# EAGLE design SerialTrainSensor_drill (EAGLE 6.1)
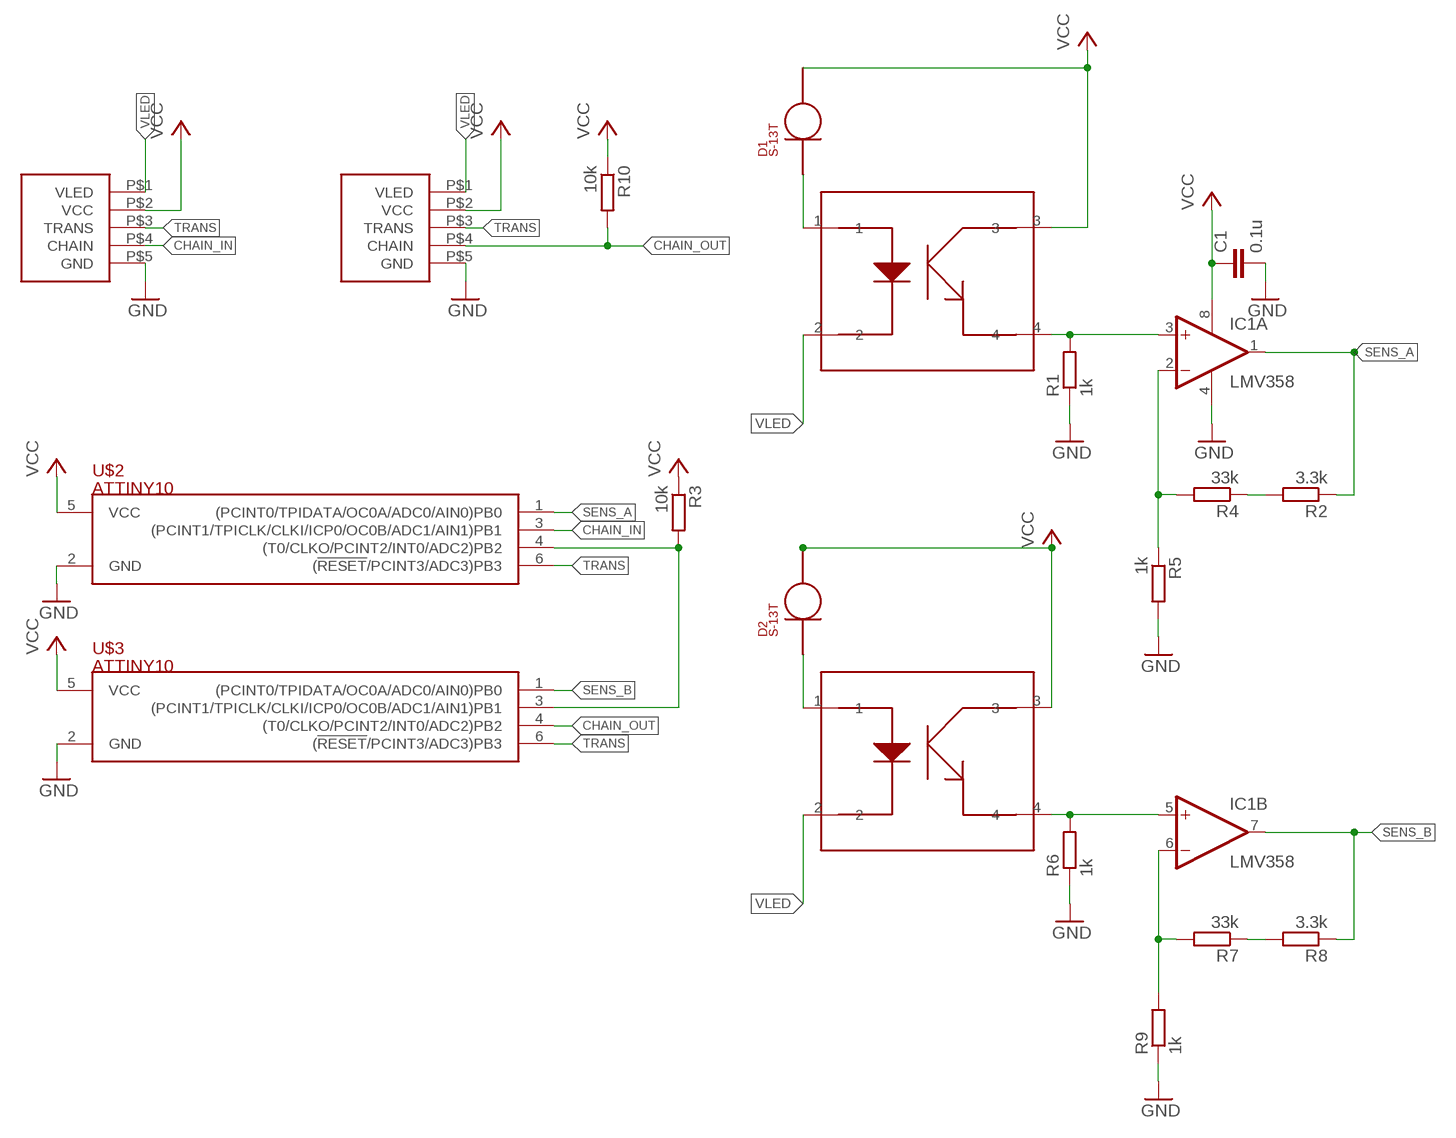
[diagram p0: schematic, sheet 1]

## Parts
C1  0.1u  C-EUC0603  [C0603]
D1  S-13T  [S-1*3T]
D2  S-13T  [S-1*3T]
IC1  LMV358  [TSSOP8]
R1  1k  R-EU_R0603  [R0603]
R2  3.3k  R-EU_R0603  [R0603]
R3  10k  R-EU_R0603  [R0603]
R4  33k  R-EU_R0603  [R0603]
R5  1k  R-EU_R0603  [R0603]
R6  1k  R-EU_R0603  [R0603]
R7  33k  R-EU_R0603  [R0603]
R8  3.3k  R-EU_R0603  [R0603]
R9  1k  R-EU_R0603  [R0603]
R10  10k  R-EU_R0603  [R0603]
SMD1  SERIAL_SENSORHALF  [SERIAL_5_HALF]
SMD2  SERIAL_SENSORHALF  [SERIAL_5_HALF]
U$1  TPR-105F  [TPR-105F]
U$2  ATTINY10  [SOT-23]
U$3  ATTINY10  [SOT-23]
U$4  TPR-105F  [TPR-105F]

## Nets
CHAIN_IN: SMD1.P$4(CHAIN) U$2.3((PCINT1/TPICLK/CLKI/ICP0/OC0B/ADC1/AIN1)PB1)
CHAIN_OUT: R10.2 SMD2.P$4(CHAIN) U$3.4((T0/CLKO/PCINT2/INT0/ADC2)PB2)
GND: C1.2 IC1.4(P:V-) R1.1 R5.2 R6.1 R9.1 SMD1.P$5(GND) SMD2.P$5(GND) U$2.2(GND) U$3.2(GND)
N$1: D1.C U$1.1
N$2: IC1.3(A:+IN) R1.2 U$1.4
N$3: D2.C U$4.1
N$4: R3.2 U$2.4((T0/CLKO/PCINT2/INT0/ADC2)PB2) U$3.3((PCINT1/TPICLK/CLKI/ICP0/OC0B/ADC1/AIN1)PB1)
N$5: IC1.5(B:+IN) R6.2 U$4.4
N$6: IC1.2(A:-IN) R4.2 R5.1
N$7: IC1.6(B:-IN) R7.2 R9.2
N$8: R2.2 R4.1
N$9: R7.1 R8.2
SENS_A: IC1.1(A:OUT) R2.1 U$2.1((PCINT0/TPIDATA/OC0A/ADC0/AIN0)PB0)
SENS_B: IC1.7(B:OUT) R8.1 U$3.1((PCINT0/TPIDATA/OC0A/ADC0/AIN0)PB0)
TRANS: SMD1.P$3(TRANS) SMD2.P$3(TRANS) U$2.6((!RESET!/PCINT3/ADC3)PB3) U$3.6((!RESET!/PCINT3/ADC3)PB3)
VCC [vcc]: C1.1 D1.A D2.A IC1.8(P:V+) R3.1 R10.1 SMD1.P$2(VCC) SMD2.P$2(VCC) U$1.3 U$2.5(VCC) U$3.5(VCC) U$4.3
VLED [led]: SMD1.P$1(VLED) SMD2.P$1(VLED) U$1.2 U$4.2

## Library data of the parts
C1 = rcl:C-EU: CAPACITOR, European symbol
D1 D2 = myparts:S-1*3T
IC1 = myparts:LMV358?*: Dual General Purpose, Low Voltage, Rail-to-Rail Output Operational Amplifiers Source: http://www.national.com/mpf/LM/LMV321.html http://www.national.com/dt/lmv_qual.pdf
R1-R10 = rcl:R-EU_: RESISTOR, European symbol
SMD1 SMD2 = myparts:SERIAL_SENSOR
U$1 U$4 = myparts:TPR-105F
U$2 U$3 = myparts:ATTINY10

## Net classes
1 led: width 0.381 mm
2 vcc: width 0.254 mm

## Board
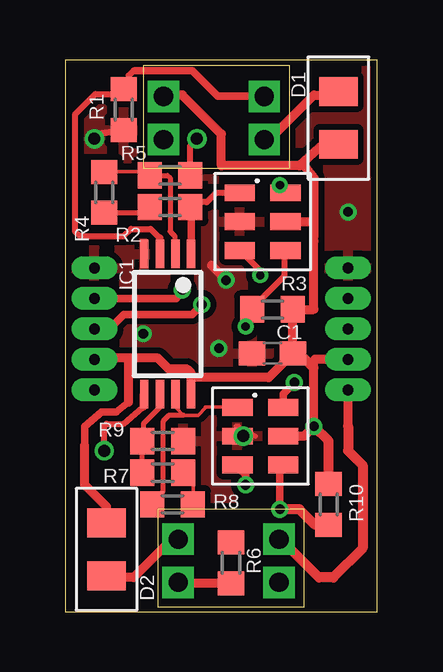
[diagram p1: board, top side]
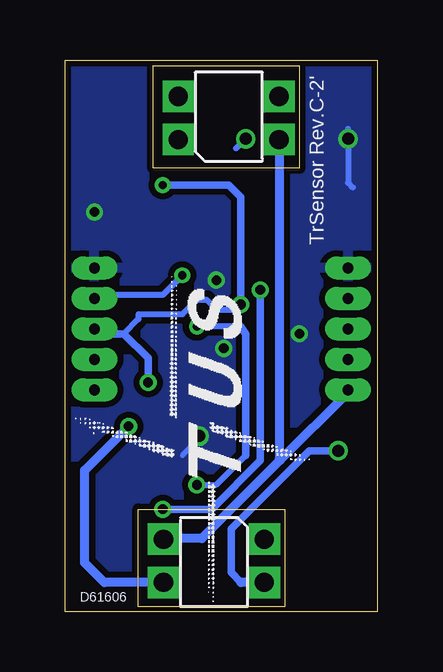
[diagram p2: board, bottom side, seen from below]

Size 13 x 23 mm. Coordinates in mm from the lower left corner, seen from the top.
Outline: 0,0 13,0 13,23 0,23 0,0
Copper layers (1*16): Top 0.035mm / dielectric 1.5mm / Bottom 0.035mm
Design rules: minimum track width 6mil, minimum drill 12mil, track to track 6mil, track to pad 6mil, pad to pad 6mil, via to via 6mil, smd to smd 0mil, copper to edge 10mil, drill to drill 10mil, minimum pad ring 10mil, minimum via ring 6mil, stop-mask expansion 2mil, vias tented up to drill 100mil, thermal gap 10mil

### Footprints (pad centres in the part's own frame; a part is rotated, then mirrored left to right if it is on the bottom)
C0603 = smd 1.1 x 1: 1 -0.85,0; 2 0.85,0
S-1*3T = smd 1.2 x 1.6: A 1.1,0; C -1.1,0
TSSOP8 = smd 0.35 x 1.2: 1 -0.975,-2.925; 2 -0.325,-2.925; 3 0.325,-2.925; 4 0.975,-2.925; 5 0.975,2.925; 6 0.325,2.925; 7 -0.325,2.925; 8 -0.975,2.925
R0603 = smd 1 x 1.1: 1 -0.85,0; 2 0.85,0
SERIAL_5_HALF = drill 0.45 long: P$1 -2.54,0; P$2 -1.27,0; P$3 0,0; P$4 1.27,0; P$5 2.54,0
TPR-105F = drill 0.8 square: 1 2.7,1.5; 2 -1.5,1.5; 3 -1.5,-0.3; 4 2.7,-0.3
SOT-23 = smd 0.7 x 1.254: 1 -1.2,-0.95; 2 0,-0.95; 3 1.2,-0.95; 4 1.2,0.95; 5 0,0.95; 6 -1.2,0.95

### Placement (x,y rotation side)
C1  8.64,10.77 180 top
D1  11.38,20.58 270 top
D2  1.72,2.59 90 top
IC1  4.27,11.99 180 top
R1  2.44,20.93 90 top
R2  4.37,16.87 180 top
R3  8.64,12.6 180 top
R4  1.63,17.48 90 top
R5  4.37,18.19 0 top
R6  6.91,2.03 270 top
R7  4.06,5.79 180 top
R8  4.47,4.47 0 top
R9  4.06,7.11 180 top
R10  10.97,4.47 270 top
SMD1  11.79,11.79 90 top
SMD2  1.22,11.79 90 top
U$1  5.59,21.18 180 bottom
U$2  8.23,16.26 270 top
U$3  8.13,7.32 270 top
U$4  7.41,1.52 0 bottom

### Tracks (layer width: path | path; a pad name or v marks a point on that pad's centre or on a via)
CHAIN_IN  (via drill 0.35)
  Top 0.254: U$2.3 7.3,15.06 8.13,14.22 v8.13,14.02
  Bottom 0.152: SMD1.P$4 11.76,13.03
  Bottom 0.254: v8.13,14.02 8.94,13.21 11.63,13.21 SMD1.P$4
  Bottom 0.305: 11.58,13.21 11.76,13.03 11.79,13.01
CHAIN_OUT  (via drill 0.4)
  Top 0.305: SMD2.P$4 4.62,13.06 v4.88,13.41 | v8.94,4.27 8.94,5.98 U$3.4
  Top 0.406: R10.2 10.4,3.62 9.75,4.27 v8.94,4.27
  Bottom 0.305: v8.94,4.27 6.91,4.27 4.88,6.3 v4.88,13.41
GND  (via drill 0.4, 0.5)
  Top 0.152: 7.21,7.72 7.18,7.71 | 7.21,7.32 U$3.2 7.21,7.32 | 7.32,16.26 U$2.2 7.32,16.26
  Top 0.203: 7.21,7.72 7.11,7.72 7.92,7.32 v7.42,7.32
  Top 0.254: 1.02,19.91 1.05,19.88 R1.1 1.39,19.88 v1.22,19.71 | R5.2 5.22,19.44 v5.49,19.71
  Top 0.381: 6.1,14.43 v6.71,13.82
  Bottom 0.203: v7.42,7.32 7.32,7.32 8.13,6.5
  Bottom 0.254: 1.22,20.12 v1.22,19.71 1.22,17.88 1.02,17.68 | v5.49,19.71 5.89,19.3
  other vias: 11.79,16.66 3.25,11.58 6.4,10.97
  pour Top (isolate 0.254): -0.81,23.98 -1.02,23.98 -1.02,-0.81 14.43,-0.81 14.43,23.98
  pour Bottom (isolate 0.254): -1.83,24.79 -1.83,-2.03 15.44,-2.03 15.44,24.79
N$1
  Top 0.381: U$1.1 8.61,19.78 10.36,21.54 11.24,21.54 D1.C
N$2
  Top 0.254: 3.94,15.56 3.56,15.95 2.74,15.95 2.44,15.65 0.61,15.65 0.41,15.85 0.41,20.73 1.26,21.58 2.4,21.58 2.44,21.54 R1.2 | R1.2 2.44,21.95 | 2.91,22.55 2.85,22.55 2.64,22.35 2.64,21.98 R1.2
  Top 0.305: U$1.4 6.36,21.48 5.28,22.55 2.91,22.55 | IC1.3 3.94,15.56
N$3
  Top 0.381: U$4.1 4.44,3.02 2.85,1.42 1.79,1.42 D2.C
N$4  (via drill 0.35, 0.4)
  Top 0.152: U$3.3 7.16,6.15 7.11,6.1 | U$2.4 9.09,15.09 9.14,15.04
  Top 0.254: v7.52,11.89 7.58,11.79 R3.2 7.79,12.66 9.14,14.02 9.14,15.04
  Top 0.305: v7.52,5.28 7.52,5.69 7.11,6.1
  Bottom 0.254: v7.52,5.28 6.71,5.28 5.49,6.5 | 5.69,11.89 v7.52,11.89
  Bottom 0.305: 5.49,6.5 5.49,11.58 5.69,11.89
N$5  (via drill 0.5)
  Top 0.254: v1.63,6.71 1.63,7.72 1.73,7.82 2.44,7.82 3.25,8.53
  Top 0.305: 3.25,8.53 3.25,9.02 IC1.5
  Top 0.381: R6.2 4.74,1.18 U$4.4
  Bottom 0.305: v1.63,6.71 2.85,6.71 6.1,3.45 6.1,1.63 5.69,1.22
  Bottom 0.381: U$4.4 5.69,1.22
N$6
  Top 0.152: 3.5,18.19 R5.1 3.5,18.24 3.5,18.34 R4.2
  Top 0.203: R5.1 4.27,18.19 4.37,18.09 4.37,15.85 4.57,15.65 4.57,14.93 IC1.2
N$7
  Top 0.152: 3.2,7.32 R9.2 3.25,7.21 | 3.4,5.89 R7.2
  Top 0.203: IC1.6 3.94,8.51 3.25,7.82 3.25,7.35 R9.2 3.42,7.11 | R7.2 3.21,7.08 3.25,7.11 3.25,7.21 3.25,7.32
N$8
  Top 0.203: R4.1 3.28,16.62 R2.2
N$9
  Top 0.152: R8.2 5.33,4.57 5.33,5.23 5.13,5.44 5.13,5.89 R7.1
SENS_A
  Top 0.152: 5.38,16.46 5.24,16.46 | 5.49,17.07 5.38,17.02 5.38,16.97 5.33,16.92 5.33,16.76 5.28,16.71 R2.1 5.23,16.87 5.23,16.76 5.24,16.62
  Top 0.254: U$2.1 6.28,17.46 5.89,17.07 5.49,17.07
  Top 0.305: IC1.1 5.24,16.46 5.24,16.62 5.28,16.66
SENS_B
  Top 0.152: U$3.1 7.16,8.53 5.84,8.53 5.84,8.48 5.54,8.18 4.93,8.18 4.62,8.48 IC1.7
  Top 0.203: 4.93,8.18 4.32,8.18 4.06,7.92 4.06,5.02 R8.1
TRANS  (via drill 0.35, 0.4)
  Top 0.152: 8.94,17.48 9.04,17.48 U$2.6
  Top 0.254: v8.94,17.78 8.94,17.48
  Top 0.305: U$3.6 9.08,9.08 v9.55,9.55 | SMD2.P$3 1.83,11.79 2.44,12.39 5.28,12.39 v5.69,12.8
  Bottom 0.254: v5.69,12.8 5.89,12.6 6.71,12.6 7.11,13.01 7.52,13.01 8.13,12.39 9.96,12.39 9.96,12.19 10.57,11.58
  Bottom 0.305: v9.55,9.55 9.55,10.57 10.57,11.58 11.58,11.58 SMD1.P$3 | v8.94,17.78 6.2,17.78 5.69,17.27 v5.69,12.8
VCC  (via drill 0.4)
  Top 0.254: SMD2.P$2 1.29,10.44 | 5.24,9.95 5.23,9.91 5.28,9.75 | 10.36,15.65 10.36,15.44 | 9.75,18.59 9.96,18.59
  Top 0.305: 2.64,8.74 2.13,8.33 1.52,8.33 0.81,7.72 0.81,6.91
  Top 0.381: U$3.5 9.96,7.32 v10.36,7.72 10.36,10.16 | 10.36,10.16 10.36,10.46 10.41,10.52 SMD1.P$2 | IC1.8 5.24,9.95 5.08,10.11 4.32,10.11 3.86,10.57 2.64,10.57 | U$1.3 4.14,21.54 4.88,21.54 6.5,19.91 6.5,18.59 9.75,18.59 10.74,19.48 D1.A | D2.A 1.72,4.37 0.81,5.28 0.81,6.91 | 2.64,10.57 1.42,10.57 1.29,10.44 1.22,10.36 | 2.64,8.74 2.64,10.57 | 10.36,15.44 10.36,12.6 R3.1 C1.1 | 9.96,18.59 10.36,18.09 10.36,16.26 | 10.36,16.26 10.36,15.65 | 10.36,10.16 9.96,10.57 C1.1 | 5.28,9.75 8.47,9.75 C1.1 | U$2.5 10.36,16.26
  Top 0.406: R10.1 10.97,7.11 v10.36,7.72
  Bottom 0.381: U$4.3 11.38,1.22 12.19,2.03 12.19,5.89 v10.36,7.72
VLED
  Top 0.381: 9.35,2.85 9.08,2.85 U$4.2 9.3,2.69 | 11.79,7.72 SMD1.P$1
  Top 0.406: 11.79,7.72 11.79,6.71 12.39,6.1 12.39,2.64 11.18,1.42 10.57,1.42 9.3,2.69 8.94,3.05
  Bottom 0.381: 4.06,6.3 1.22,9.14 SMD2.P$1 | 4.06,6.3 7.32,3.05 8.89,3.05 | 8.89,3.05 8.94,3.05 | U$1.2 4.09,6.33 4.06,6.3 | 8.89,3.05 U$4.2

### Text on the board
bPlace: TrSensor Rev.C-2' | D61606